# EAGLE schematic 309_rs232c (EAGLE 7.6.0)
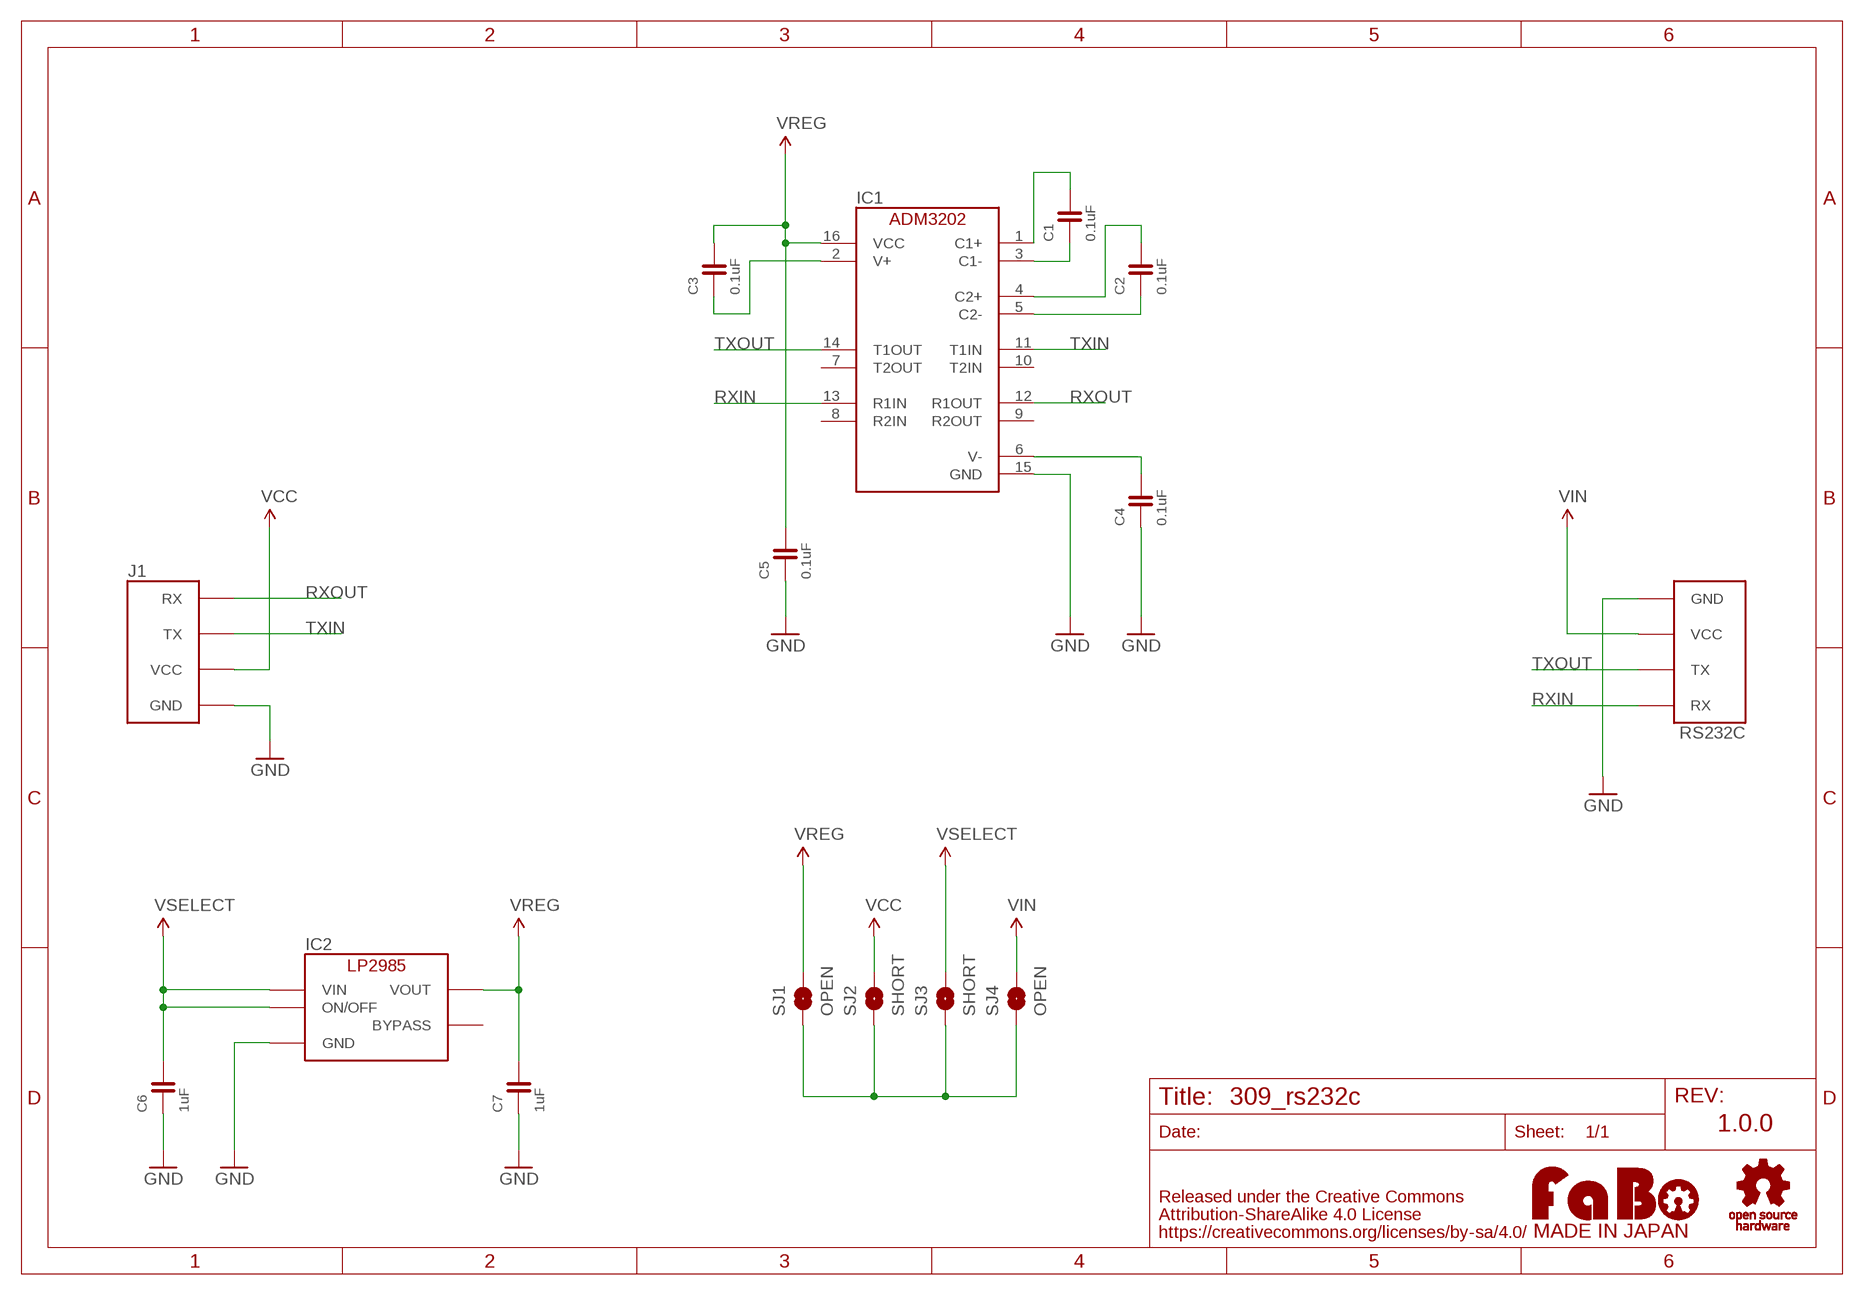
[diagram p0: schematic, sheet 1]

## Parts
C1  0.1uF  CAPACITOR-0603_NARROW  [0603-NARROW]
C2  0.1uF  CAPACITOR-0603_NARROW  [0603-NARROW]
C3  0.1uF  CAPACITOR-0603_NARROW  [0603-NARROW]
C4  0.1uF  CAPACITOR-0603_NARROW  [0603-NARROW]
C5  0.1uF  CAPACITOR-0603_NARROW  [0603-NARROW]
C6  1uF  CAPACITOR-0603_NARROW  [0603-NARROW]
C7  1uF  CAPACITOR-0603_NARROW  [0603-NARROW]
IC1  ADM3202ARU  [TSSOP-16]
IC2  LP2985-33DBV  [SOT-23-5]
J1  FABO_BRICK_SERIAL  [FABO_BRICK_SERIAL]
RS232C  FABO_BRICK_SERIAL-S04B-PASK-2_LONG  [FABO_BRICK_SERIAL_S04B-PASK-2_LONG]
SJ1  OPEN  SMD-JUMPER-2-OPEN  [SMD-JUMPER-2-OPEN]
SJ2  SHORT  SMD-JUMPER-2-SHORT  [SMD-JUMPER-2-SHORT]
SJ3  SHORT  SMD-JUMPER-2-SHORT  [SMD-JUMPER-2-SHORT]
SJ4  OPEN  SMD-JUMPER-2-OPEN  [SMD-JUMPER-2-OPEN]
U$2  LOGO_OSHW-M_BOTTOM  [LOGO_OSHW_M_BOTTOM]
U$3  LOGO_FABO-M_BOTTOM  [LOGO_FABO_MS_BOTTOM]

## Nets
GND: C4.1 C5.1 C6.1 C7.1 IC1.15(GND) IC2.2(GND) J1.GND RS232C.GND
N$5: SJ1.2 SJ2.2 SJ3.2 SJ4.2
N$6: C1.1 IC1.3(C1-)
N$7: C1.2 IC1.1(C1+)
N$8: C2.1 IC1.5(C2-)
N$9: C2.2 IC1.4(C2+)
N$10: C3.1 IC1.2(V+)
N$12: C4.2 IC1.6(V-)
RXIN: IC1.13(R1IN) RS232C.RX
RXOUT: IC1.12(R1OUT) J1.RX
TXIN: IC1.11(T1IN) J1.TX
TXOUT: IC1.14(T1OUT) RS232C.TX
VCC: J1.VCC SJ2.1
VIN: RS232C.VCC SJ4.1
VREG: C3.2 C5.2 C7.2 IC1.16(VCC) IC2.5(VOUT) SJ1.1
VSELECT: C6.2 IC2.1(VIN) IC2.3(ON/OFF) SJ3.1
Unconnected: IC1.7(T2OUT) IC1.8(R2IN) IC1.9(R2OUT) IC1.10(T2IN) IC2.4(BYPASS)

## Notes on the sheet
- 1.0.0

## Library data of the parts
C1-C7 = FaBo-Capacitor:CAPACITOR: CAPACITOR
IC1 = FaBo-LevelTranslator:ADM3202ARU
IC2 = FaBo-Supply:LP2985: LP2985
J1 RS232C = FaBo-Template:FABO_BRICK_SERIAL: FaBo Brick Serial
SJ1-SJ4 = FaBo-Supply:SMD-JUMPER-2
U$2 = FaBo-etc:LOGO_OSHW
U$3 = FaBo-etc:LOGO_FABO